# Altium schematic sheet Data.SchDoc
size B
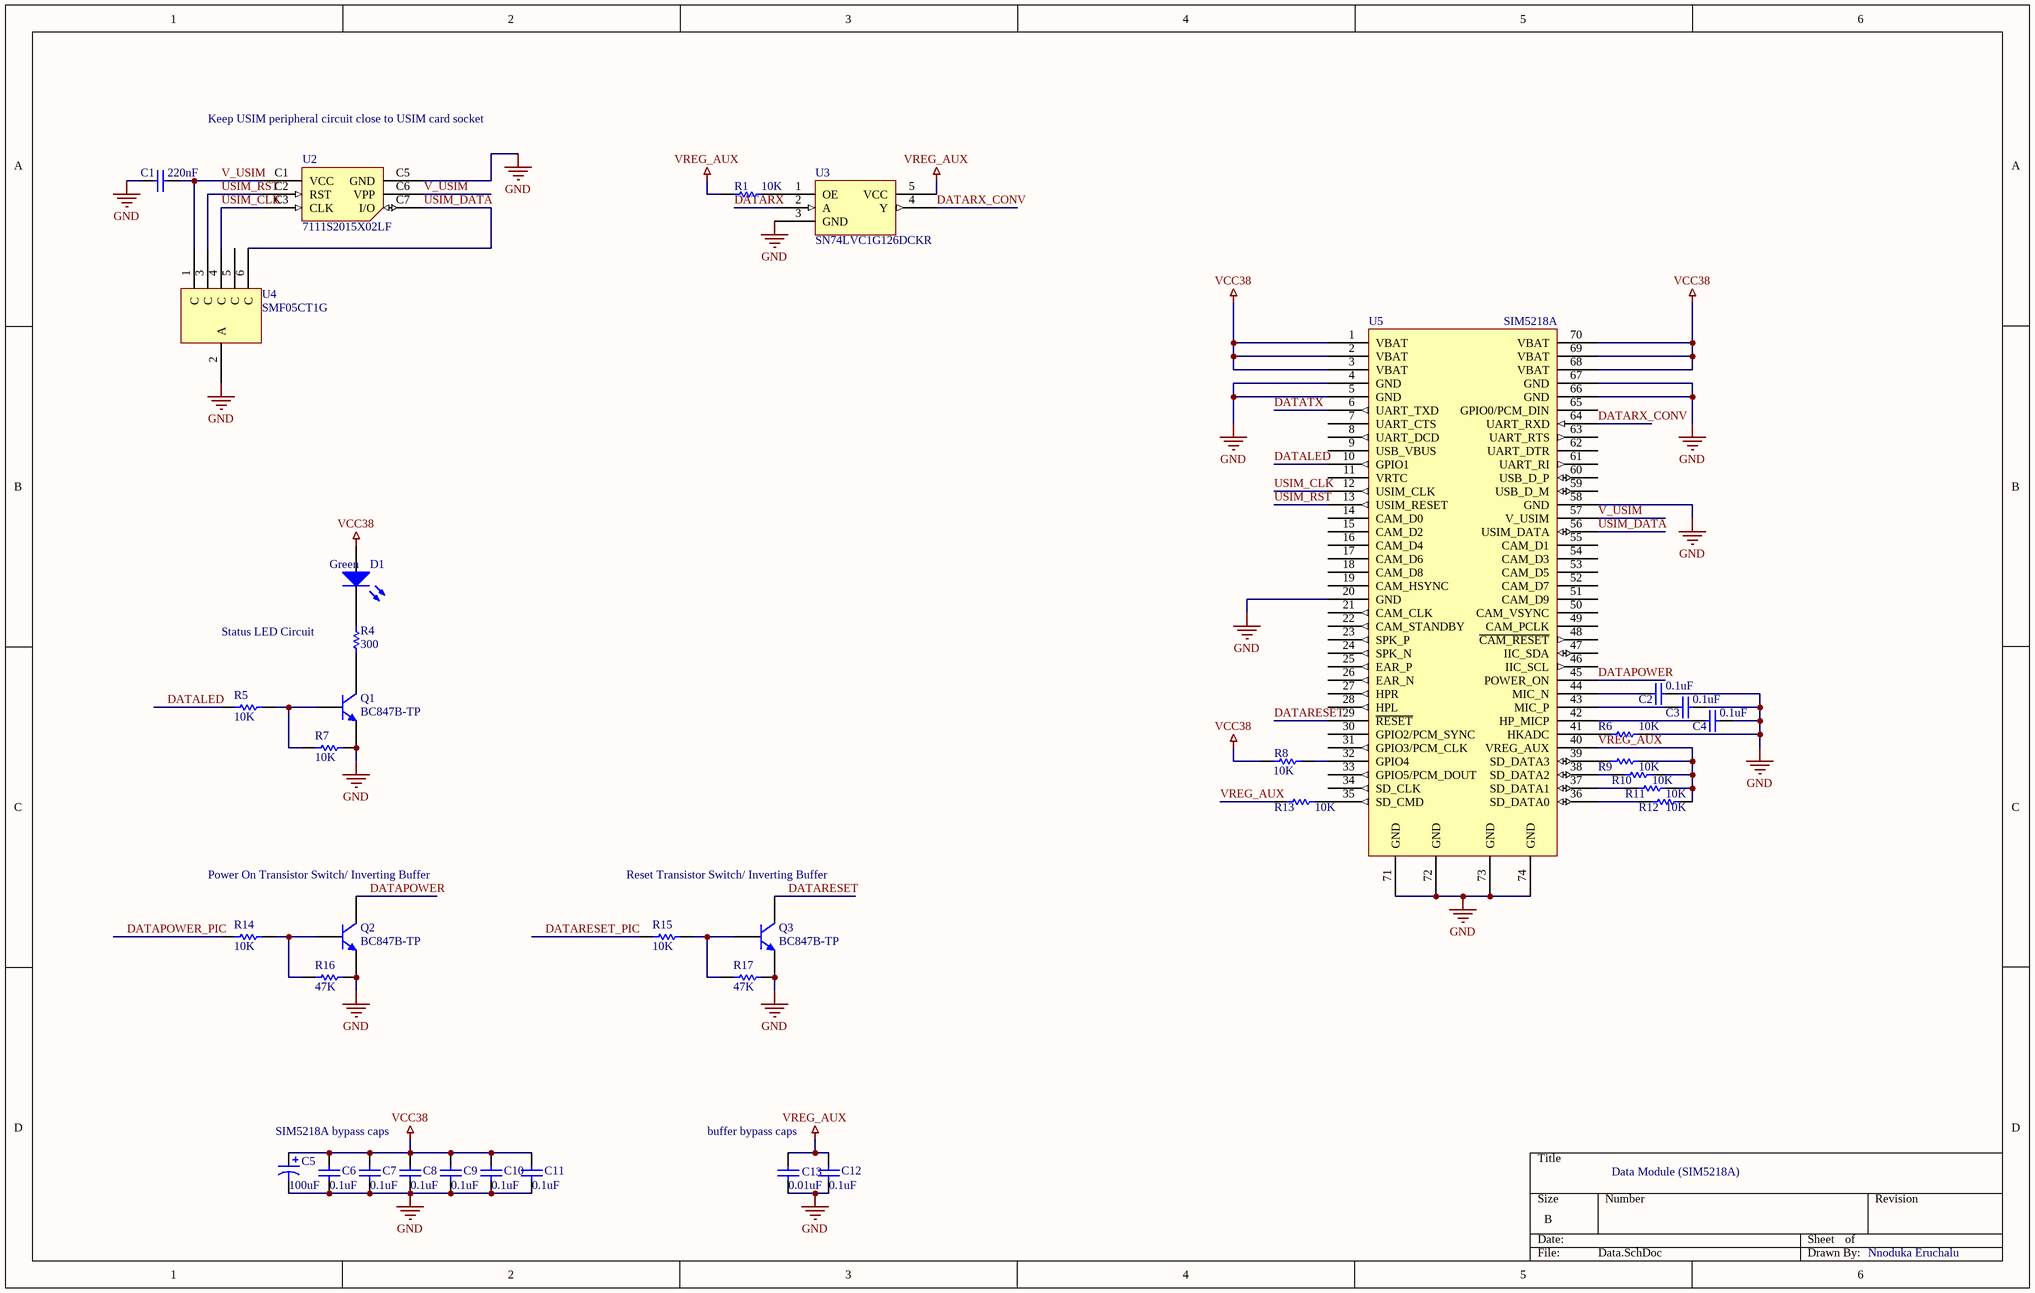
[diagram p0: Data.SchDoc]

## Parts
C1  value 220nF  [2012[0805]]  (hidden comment: C2012X7R1H224K)
C2  value 0.1uF  [2012[0805]]  (hidden comment: C2012X7R1H104K/0.85)
C3  value 0.1uF  [2012[0805]]  (hidden comment: C2012X7R1H104K/0.85)
C4  value 0.1uF  [2012[0805]]  (hidden comment: C2012X7R1H104K/0.85)
C5  value 100uF  [TC3528-1411]  (hidden comment: T520B107M004ATE070)
C6  value 0.1uF  [2012[0805]]  (hidden comment: C2012X7R1H104K/0.85)
C7  value 0.1uF  [2012[0805]]  (hidden comment: C2012X7R1H104K/0.85)
C8  value 0.1uF  [2012[0805]]  (hidden comment: C2012X7R1H104K/0.85)
C9  value 0.1uF  [2012[0805]]  (hidden comment: C2012X7R1H104K/0.85)
C10  value 0.1uF  [2012[0805]]  (hidden comment: C2012X7R1H104K/0.85)
C11  value 0.1uF  [2012[0805]]  (hidden comment: C2012X7R1H104K/0.85)
C12  value 0.1uF  [2012[0805]]  (hidden comment: C2012X7R1H104K/0.85)
C13  value 0.01uF  [2012[0805]]  (hidden comment: C2012X7R2E103K)
D1  value Green  [LTST-C17X]  (hidden comment: LTST-C171GKT)
Q1  BC847B-TP  [SOT23-3N]
Q2  BC847B-TP  [SOT23-3N]
Q3  BC847B-TP  [SOT23-3N]
R1  value 10K  [2012[0805]]  (hidden comment: ERJ-6GEYJ103V)
R4  value 300  [2012[0805]]  (hidden comment: ERJ-6GEYJ301V)
R5  value 10K  [2012[0805]]  (hidden comment: ERJ-6GEYJ103V)
R6  value 10K  [2012[0805]]  (hidden comment: ERJ-6GEYJ103V)
R7  value 10K  [2012[0805]]  (hidden comment: ERJ-6GEYJ103V)
R8  value 10K  [2012[0805]]  (hidden comment: ERJ-6GEYJ103V)
R9  value 10K  [2012[0805]]  (hidden comment: ERJ-6GEYJ103V)
R10  value 10K  [2012[0805]]  (hidden comment: ERJ-6GEYJ103V)
R11  value 10K  [2012[0805]]  (hidden comment: ERJ-6GEYJ103V)
R12  value 10K  [2012[0805]]  (hidden comment: ERJ-6GEYJ103V)
R13  value 10K  [2012[0805]]  (hidden comment: ERJ-6GEYJ103V)
R14  value 10K  [2012[0805]]  (hidden comment: ERJ-6GEYJ103V)
R15  value 10K  [2012[0805]]  (hidden comment: ERJ-6GEYJ103V)
R16  value 47K  [2012[0805]]  (hidden comment: ERJ-6GEYJ473V)
R17  value 47K  [2012[0805]]  (hidden comment: ERJ-6GEYJ473V)
U2  7111S2015X02LF  [7111S2015X02LF]
U3  SN74LVC1G126DCKR  [SOT353-5N]
U4  SMF05CT1G  [SOT363-6N]
U5  SIM5218A  [SIM5218A v2]

## Nets
GND: C1.1 C2.2 C3.2 C4.2 C5.2 C6.1 C7.1 C8.1 C9.1 C10.1 C11.1 C12.1 C13.1 Q1.2(E) Q2.2(E) Q3.2(E) R6.2 R7.1 R16.1 R17.1 U2.C5(GND) U3.3(GND) U4.2(A) U5.4(GND) U5.5(GND) U5.20(GND) U5.58(GND) U5.66(GND) U5.67(GND) U5.71(GND) U5.72(GND) U5.73(GND) U5.74(GND)
VCC38: C5.1 C6.2 C7.2 C8.2 C9.2 C10.2 C11.2 D1.1(A) R8.1 U5.1(VBAT) U5.2(VBAT) U5.3(VBAT) U5.68(VBAT) U5.69(VBAT) U5.70(VBAT)
VREG_AUX: C12.2 C13.2 R1.2 R9.2 R10.2 R11.2 R12.2 R13.1 U3.5(VCC) U5.40(VREG_AUX)
DATALED: R5.2 U5.10(GPIO1)
DATAPOWER: Q2.3(C) U5.45(POWER_ON)
DATAPOWER_PIC: R14.2
DATARESET: Q3.3(C) U5.29(~{RESET})
DATARESET_PIC: R15.2
DATARX: U3.2(A)
DATARX_CONV: U3.4(Y) U5.64(UART_RXD)
DATATX: U5.6(UART_TXD)
USIM_CLK: U2.C3(CLK) U4.4(C) U5.12(USIM_CLK)
USIM_DATA: U2.C7(I/O) U4.6(C) U5.56(USIM_DATA)
USIM_RST: U2.C2(RST) U4.3(C) U5.13(USIM_RESET)
V_USIM: C1.2 U2.C1(VCC) U2.C6(VPP) U4.1(C) U5.57(V_USIM)
NetC2_1: C2.1 U5.44(MIC_N)
NetC3_1: C3.1 U5.43(MIC_P)
NetC4_1: C4.1 U5.42(HP_MICP)
NetD1_2: D1.2(K) R4.1
NetQ1_1: Q1.1(B) R5.1 R7.2
NetQ1_3: Q1.3(C) R4.2
NetQ2_1: Q2.1(B) R14.1 R16.2
NetQ3_1: Q3.1(B) R15.1 R17.2
NetR1_1: R1.1 U3.1(OE)
NetR6_1: R6.1 U5.41(HKADC)
NetR8_2: R8.2 U5.32(GPIO4)
NetR9_1: R9.1 U5.39(SD_DATA3)
NetR10_1: R10.1 U5.38(SD_DATA2)
NetR11_1: R11.1 U5.37(SD_DATA1)
NetR12_1: R12.1 U5.36(SD_DATA0)
NetR13_2: R13.2 U5.35(SD_CMD)

Not connected (* = marked no-connect by the designer): U4 5(C); U5 7(UART_CTS) 8(UART_DCD) 9(USB_VBUS) 11(VRTC) 14(CAM_D0) 15(CAM_D2) 16(CAM_D4) 17(CAM_D6) 18(CAM_D8) 19(CAM_HSYNC) 21(CAM_CLK) 22(CAM_STANDBY) 23(SPK_P) 24(SPK_N) 25(EAR_P) 26(EAR_N) 27(HPR) 28(HPL) 30(GPIO2/PCM_SYNC) 31(GPIO3/PCM_CLK) 33(GPIO5/PCM_DOUT) 34(SD_CLK) 46(IIC_SCL) 47(IIC_SDA) 48(~{CAM_RESET}) 49(CAM_PCLK) 50(CAM_VSYNC) 51(CAM_D9) 52(CAM_D7) 53(CAM_D5) 54(CAM_D3) 55(CAM_D1) 59(USB_D_M) 60(USB_D_P) 61(UART_RI) 62(UART_DTR) 63(UART_RTS) 65(GPIO0/PCM_DIN)

## Notes on the sheet
- Keep USIM peripheral circuit close to USIM card socket
- (near R4) Status LED Circuit
- Power On Transistor Switch/ Inverting Buffer
- Reset Transistor Switch/ Inverting Buffer
- SIM5218A bypass caps
- buffer bypass caps
- Data Module (SIM5218A)
- Nnoduka Eruchalu

## Library data of the parts
C1-C4 C6-C13 = C0805: Ceramic Chip Capacitor - Standard; Note: Footprint corresponds to dimensions for bulk cassette packaging. This case size has tightened tolerances.; Published: 17-Jul-2002; LatestRevisionDate: 19-Mar-2004; LatestRevisionNote: Silkscreen size reduced.; DatasheetDocument: Mar-2001; PackageDocument: Mar-2001; PackageReference: 0805; Publisher: Altium Limited; Code_JEITA: 0805; Code_IPC: 2012[0805]; ComponentLink1Description: Manufacturer Link; ComponentLink1URL: http://www.kemet.com/; ComponentLink2Description: Datasheet; ComponentLink2URL: http://www.kemet.com/kemet/web/homepage/kechome.nsf/vapubfilesname/F3102TA.pdf/$file/F3102TA.pdf
C5 = Cap Pol1: Polarized Capacitor (Radial); Published: 8-Jun-2000; LatestRevisionDate: 17-Jul-2002; LatestRevisionNote: Re-released for DXP Platform.; PackageReference: RB7.6-15; Publisher: Altium Limited
D1 = LED2: Typical RED, GREEN, YELLOW, AMBER GaAs LED; Published: 8-Jun-2000; LatestRevisionDate: 17-Jul-2002; LatestRevisionNote: Re-released for DXP Platform.; PackageDocument: Feb-2002; PackageReference: 3.2X1.6X1.1; Publisher: Altium Limited
Q1-Q3 = NPN: NPN Bipolar Transistor; Published: 8-Jun-2000; LatestRevisionDate: 17-Jul-2002; LatestRevisionNote: Re-released for DXP Platform.; PackageReference: TO-226; Publisher: Altium Limited; Code_JEDEC: TO-226-AA
R1 R4-R17 = Res1: Resistor; Published: 8-Jun-2000; LatestRevisionDate: 17-Jul-2002; LatestRevisionNote: Re-released for DXP Platform.; PackageReference: AXIAL-0.3; Publisher: Altium Limited
U3 = SN74LVC1G126
U4 = SMF05C